# Altium project Main Processor Board.PrjPcb
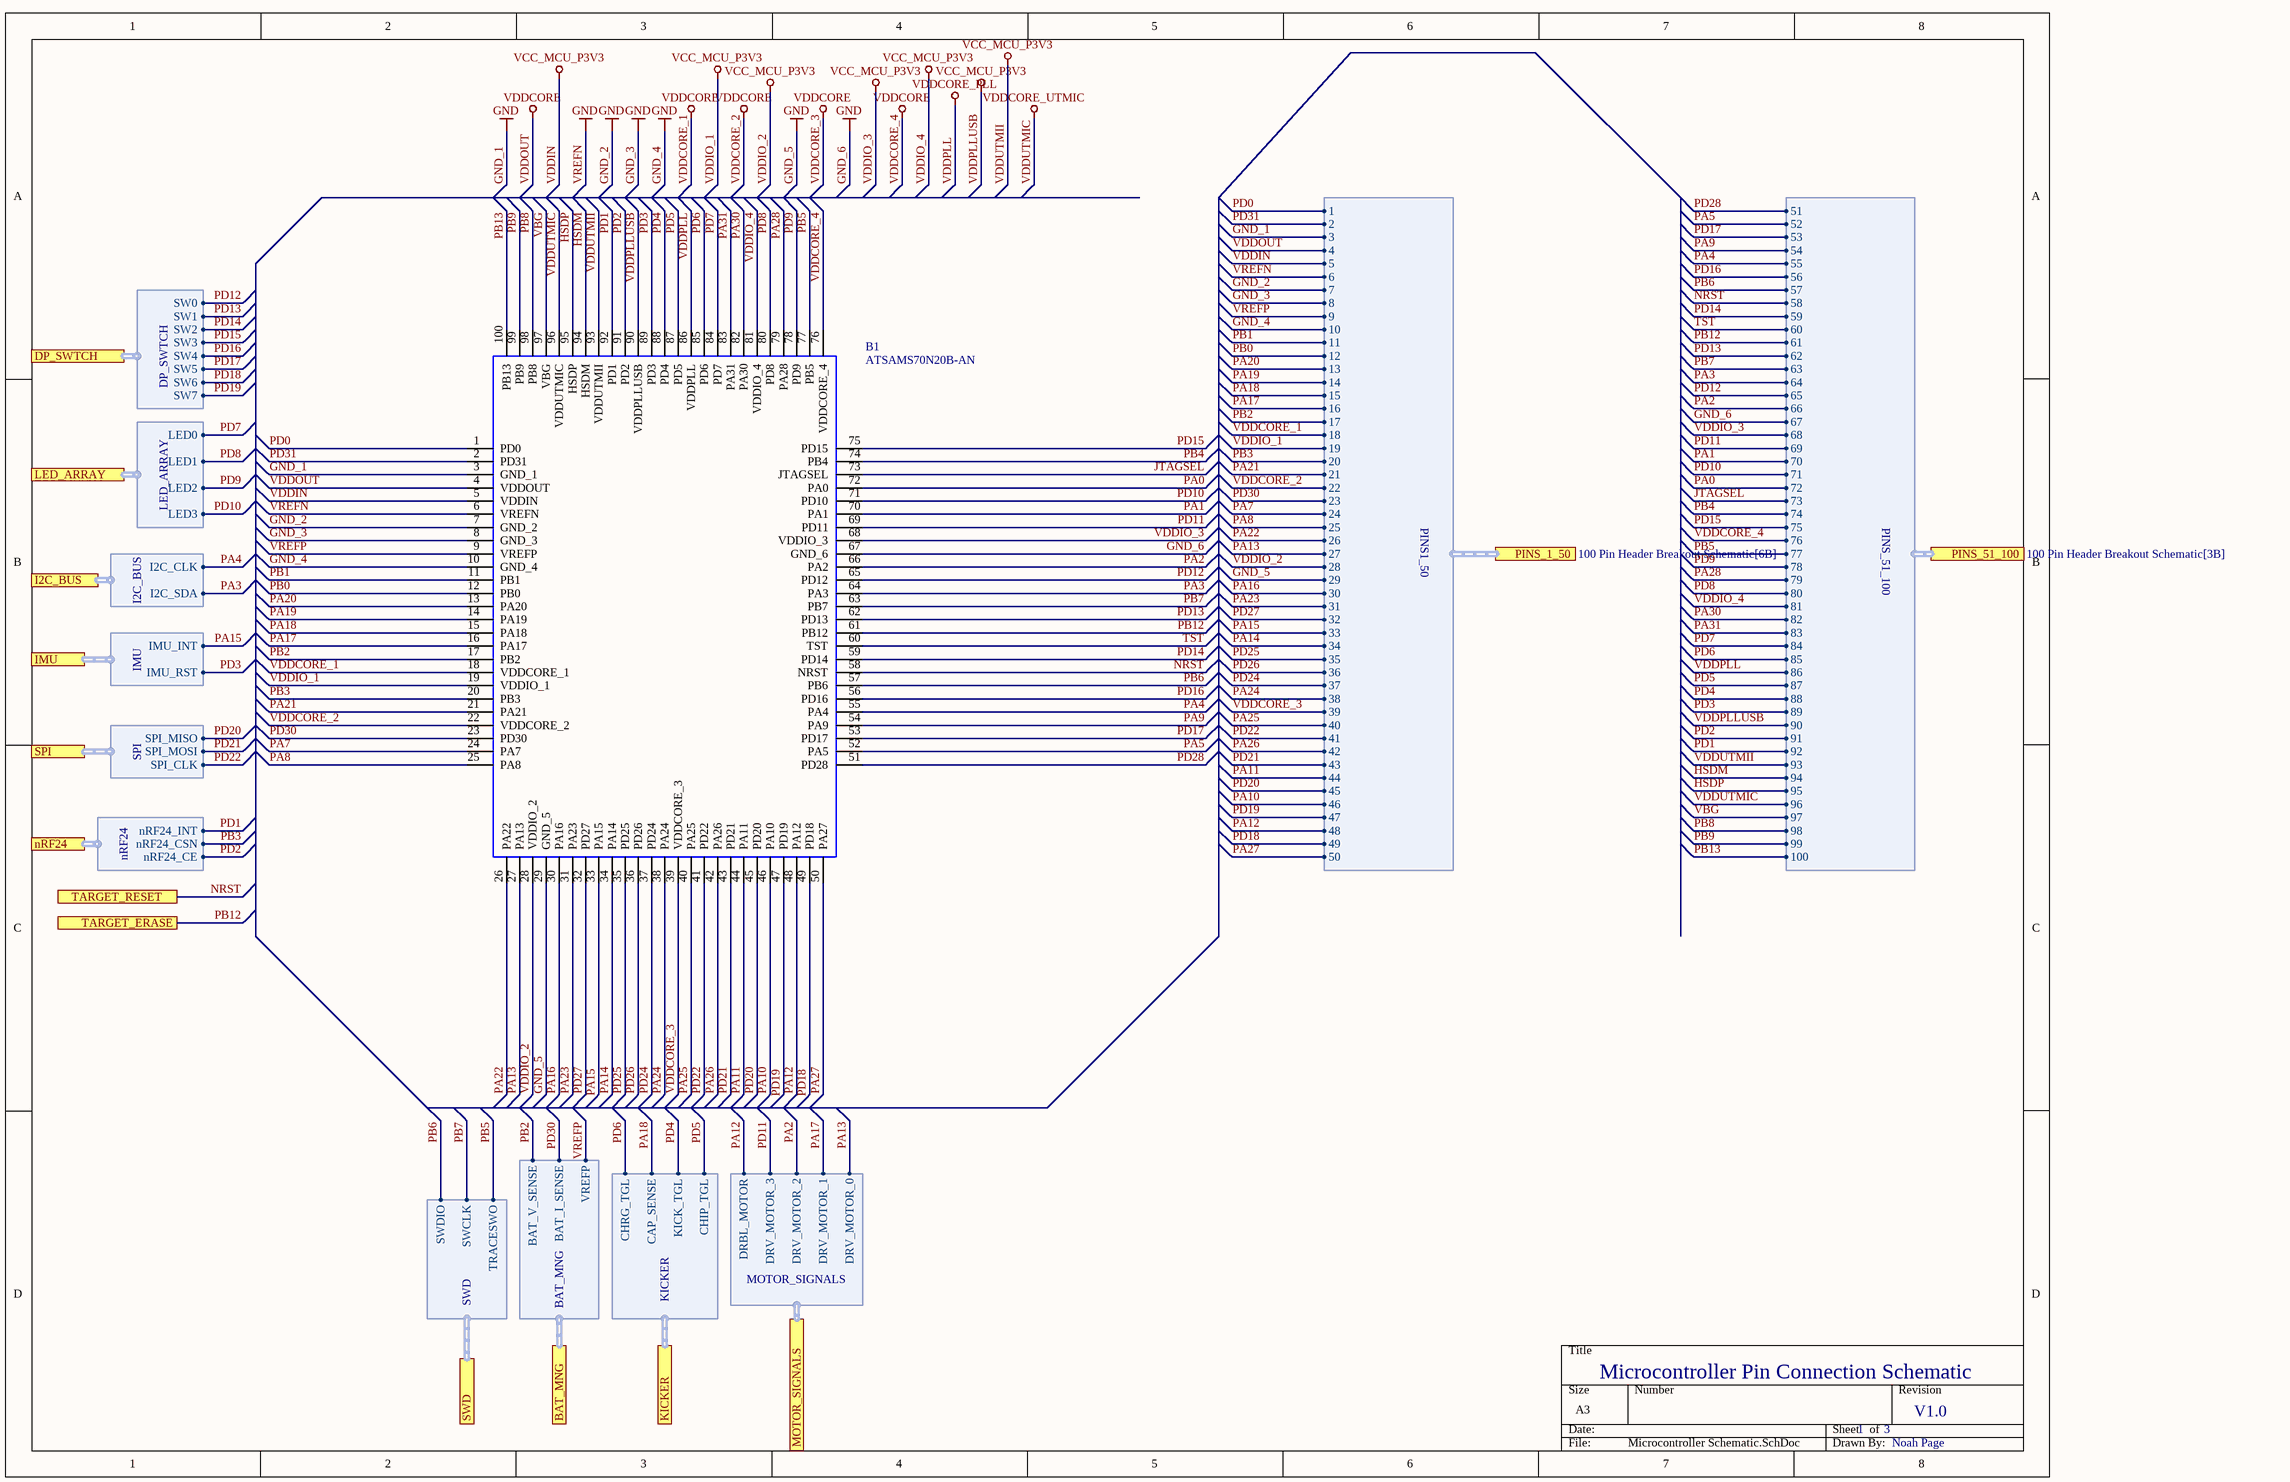
[diagram p0: Microcontroller Schematic.SchDoc]
3 sheets, 68 parts. Net scope: global (net labels, ports and power ports of the same name join across sheets).
Board file: Main Processor Board PCB.PcbDoc
Sheets:
  Microcontroller Schematic.SchDoc
  100 Pin Header Breakout Schematic.SchDoc
  Circuit Schematics.SchDoc

## Sheet Microcontroller Schematic.SchDoc
size A3; SheetNumber: 1; SheetTotal: 3

### Parts
B1  ATSAMS70N20B-AN  [QFP50P1600X1600X160-100N]

### Ports
BAT_MNG (harness BAT_MNG, see Circuit Schematics[6D]), DP_SWTCH (harness DP_SWTCH, see Circuit Schematics[1A]), I2C_BUS (harness I2C_BUS, see Circuit Schematics[1D], Circuit Schematics[3B], Circuit Schematics[6D]), IMU (harness IMU, see Circuit Schematics[1D]), KICKER (harness KICKER, see Circuit Schematics[6C]), LED_ARRAY (harness LED_ARRAY, see Circuit Schematics[1C]), MOTOR_SIGNALS (harness MOTOR_SIGNALS, see Circuit Schematics[5A]), nRF24 (harness nRF24, see Circuit Schematics[3D]), PINS_1_50 (harness PINS1_50, see 100 Pin Header Breakout Schematic[6B]), PINS_51_100 (harness PINS_51_100, see 100 Pin Header Breakout Schematic[3B]), SPI (harness SPI, see Circuit Schematics[3C]), SWD (harness SWD, see Circuit Schematics[5B]), TARGET_ERASE (see Circuit Schematics[3A]), TARGET_RESET (see Circuit Schematics[3A], Circuit Schematics[4B])

### Harnesses
DP_SWTCH: SW0, SW1, SW2, SW3, SW4, SW5, SW6, SW7
LED_ARRAY: LED0, LED1, LED2, LED3
I2C_BUS: I2C_CLK, I2C_SDA
IMU: IMU_INT, IMU_RST
SPI: SPI_MISO, SPI_MOSI, SPI_CLK
nRF24: nRF24_CSN, nRF24_CE, nRF24_INT
SWD: SWDIO, SWCLK, TRACESWO
BAT_MNG: BAT_V_SENSE, BAT_I_SENSE, VREFP
KICKER: CAP_SENSE, CHRG_TGL, KICK_TGL, CHIP_TGL
MOTOR_SIGNALS: DRV_MOTOR_0, DRV_MOTOR_1, DRV_MOTOR_2, DRV_MOTOR_3, DRBL_MOTOR
PINS1_50: 1, 2, 3, 4, 5, 6, 7, 8, 9, 10, 11, 12, 13, 14, 15, 16, 17, 18, 19, 20, 21, 22, 23, 24, 25, 26, 27, 28, 29, 30, 31, 32, 33, 34, 35, 36, 37, 38, 39, 40, 41, 42, 43, 44, 45, 46, 47, 48, 49, 50
PINS_51_100: 51, 52, 53, 54, 55, 56, 57, 58, 59, 60, 61, 62, 63, 64, 65, 66, 67, 68, 69, 70, 71, 72, 73, 74, 75, 76, 77, 78, 79, 80, 81, 82, 83, 84, 85, 86, 87, 88, 89, 90, 91, 92, 93, 94, 95, 96, 97, 98, 99, 100

### Nets
GND_1: B1.3(GND_1) B1.6(VREFN) B1.7(GND_2) B1.8(GND_3) B1.10(GND_4) B1.29(GND_5) B1.67(GND_6) ; port PINS_1_50.3, port PINS_1_50.6, port PINS_1_50.7, port PINS_1_50.8, port PINS_1_50.10, port PINS_1_50.29, port PINS_51_100.67  [also labelled GND, GND_2, GND_3, GND_4, GND_5, GND_6, VREFN]
VDDCORE_1: B1.4(VDDOUT) B1.18(VDDCORE_1) B1.22(VDDCORE_2) B1.39(VDDCORE_3) B1.76(VDDCORE_4) ; port PINS_1_50.4, port PINS_1_50.18, port PINS_1_50.22, port PINS_1_50.39, port PINS_51_100.76  [also labelled VDDCORE, VDDCORE_2, VDDCORE_3, VDDCORE_4, VDDOUT]
VDDIN: B1.5(VDDIN) B1.19(VDDIO_1) B1.28(VDDIO_2) B1.68(VDDIO_3) B1.81(VDDIO_4) B1.90(VDDPLLUSB) B1.93(VDDUTMII) ; port PINS_1_50.5, port PINS_1_50.19, port PINS_1_50.28, port PINS_51_100.68, port PINS_51_100.81, port PINS_51_100.90, port PINS_51_100.93  [also labelled VCC_MCU_P3V3, VDDIO_1, VDDIO_2, VDDIO_3, VDDIO_4, VDDPLLUSB, VDDUTMII]
VDDPLL: B1.86(VDDPLL) ; port PINS_51_100.86  [also labelled VDDCORE_PLL]
VDDUTMIC: B1.96(VDDUTMIC) ; port PINS_51_100.96  [also labelled VDDCORE_UTMIC]
HSDM: B1.94(HSDM) ; port PINS_51_100.94
HSDP: B1.95(HSDP) ; port PINS_51_100.95
JTAGSEL: B1.73(JTAGSEL) ; port PINS_51_100.73
NRST: B1.58(NRST) ; port TARGET_RESET, port PINS_51_100.58
PA0: B1.72(PA0) ; port PINS_51_100.72
PA1: B1.70(PA1) ; port PINS_51_100.70
PA2: B1.66(PA2) ; port MOTOR_SIGNALS.DRV_MOTOR_2, port PINS_51_100.66
PA3: B1.64(PA3) ; port I2C_BUS.I2C_SDA, port PINS_51_100.64
PA4: B1.55(PA4) ; port I2C_BUS.I2C_CLK, port PINS_51_100.55
PA5: B1.52(PA5) ; port PINS_51_100.52
PA7: B1.24(PA7) ; port PINS_1_50.24
PA8: B1.25(PA8) ; port PINS_1_50.25
PA9: B1.54(PA9) ; port PINS_51_100.54
PA10: B1.46(PA10) ; port PINS_1_50.46
PA11: B1.44(PA11) ; port PINS_1_50.44
PA12: B1.48(PA12) ; port MOTOR_SIGNALS.DRBL_MOTOR, port PINS_1_50.48
PA13: B1.27(PA13) ; port MOTOR_SIGNALS.DRV_MOTOR_0, port PINS_1_50.27
PA14: B1.34(PA14) ; port PINS_1_50.34
PA15: B1.33(PA15) ; port IMU.IMU_INT, port PINS_1_50.33
PA16: B1.30(PA16) ; port PINS_1_50.30
PA17: B1.16(PA17) ; port MOTOR_SIGNALS.DRV_MOTOR_1, port PINS_1_50.16
PA18: B1.15(PA18) ; port KICKER.CAP_SENSE, port PINS_1_50.15
PA19: B1.14(PA19) ; port PINS_1_50.14
PA20: B1.13(PA20) ; port PINS_1_50.13
PA21: B1.21(PA21) ; port PINS_1_50.21
PA22: B1.26(PA22) ; port PINS_1_50.26
PA23: B1.31(PA23) ; port PINS_1_50.31
PA24: B1.38(PA24) ; port PINS_1_50.38
PA25: B1.40(PA25) ; port PINS_1_50.40
PA26: B1.42(PA26) ; port PINS_1_50.42
PA27: B1.50(PA27) ; port PINS_1_50.50
PA28: B1.79(PA28) ; port PINS_51_100.79
PA30: B1.82(PA30) ; port PINS_51_100.82
PA31: B1.83(PA31) ; port PINS_51_100.83
PB0: B1.12(PB0) ; port PINS_1_50.12
PB1: B1.11(PB1) ; port PINS_1_50.11
PB2: B1.17(PB2) ; port BAT_MNG.BAT_V_SENSE, port PINS_1_50.17
PB3: B1.20(PB3) ; port nRF24.nRF24_CSN, port PINS_1_50.20
PB4: B1.74(PB4) ; port PINS_51_100.74
PB5: B1.77(PB5) ; port SWD.TRACESWO, port PINS_51_100.77
PB6: B1.57(PB6) ; port SWD.SWDIO, port PINS_51_100.57
PB7: B1.63(PB7) ; port SWD.SWCLK, port PINS_51_100.63
PB8: B1.98(PB8) ; port PINS_51_100.98
PB9: B1.99(PB9) ; port PINS_51_100.99
PB12: B1.61(PB12) ; port TARGET_ERASE, port PINS_51_100.61
PB13: B1.100(PB13) ; port PINS_51_100.100
PD0: B1.1(PD0) ; port PINS_1_50.1
PD1: B1.92(PD1) ; port nRF24.nRF24_INT, port PINS_51_100.92
PD2: B1.91(PD2) ; port nRF24.nRF24_CE, port PINS_51_100.91
PD3: B1.89(PD3) ; port IMU.IMU_RST, port PINS_51_100.89
PD4: B1.88(PD4) ; port KICKER.KICK_TGL, port PINS_51_100.88
PD5: B1.87(PD5) ; port KICKER.CHIP_TGL, port PINS_51_100.87
PD6: B1.85(PD6) ; port KICKER.CHRG_TGL, port PINS_51_100.85
PD7: B1.84(PD7) ; port LED_ARRAY.LED0, port PINS_51_100.84
PD8: B1.80(PD8) ; port LED_ARRAY.LED1, port PINS_51_100.80
PD9: B1.78(PD9) ; port LED_ARRAY.LED2, port PINS_51_100.78
PD10: B1.71(PD10) ; port LED_ARRAY.LED3, port PINS_51_100.71
PD11: B1.69(PD11) ; port MOTOR_SIGNALS.DRV_MOTOR_3, port PINS_51_100.69
PD12: B1.65(PD12) ; port DP_SWTCH.SW0, port PINS_51_100.65
PD13: B1.62(PD13) ; port DP_SWTCH.SW1, port PINS_51_100.62
PD14: B1.59(PD14) ; port DP_SWTCH.SW2, port PINS_51_100.59
PD15: B1.75(PD15) ; port DP_SWTCH.SW3, port PINS_51_100.75
PD16: B1.56(PD16) ; port DP_SWTCH.SW4, port PINS_51_100.56
PD17: B1.53(PD17) ; port DP_SWTCH.SW5, port PINS_51_100.53
PD18: B1.49(PD18) ; port DP_SWTCH.SW6, port PINS_1_50.49
PD19: B1.47(PD19) ; port DP_SWTCH.SW7, port PINS_1_50.47
PD20: B1.45(PD20) ; port SPI.SPI_MISO, port PINS_1_50.45
PD21: B1.43(PD21) ; port SPI.SPI_MOSI, port PINS_1_50.43
PD22: B1.41(PD22) ; port SPI.SPI_CLK, port PINS_1_50.41
PD24: B1.37(PD24) ; port PINS_1_50.37
PD25: B1.35(PD25) ; port PINS_1_50.35
PD26: B1.36(PD26) ; port PINS_1_50.36
PD27: B1.32(PD27) ; port PINS_1_50.32
PD28: B1.51(PD28) ; port PINS_51_100.51
PD30: B1.23(PD30) ; port BAT_MNG.BAT_I_SENSE, port PINS_1_50.23
PD31: B1.2(PD31) ; port PINS_1_50.2
TST: B1.60(TST) ; port PINS_51_100.60
VBG: B1.97(VBG) ; port PINS_51_100.97
VREFP: B1.9(VREFP) ; port BAT_MNG.VREFP, port PINS_1_50.9

### Notes on the sheet
- Microcontroller Pin Connection Schematic
- 1
- 3
- V1.0
- Noah Page

### Library data of the parts
B1 = ATSAMS70N20B-AN: ARM Microcontrollers - MCU CM7,1024kB Flash,384kB SRAM,LQFP100; Manufacturer_Name: Microchip; Geometry.Height: 1.6mm; Mouser Part Number: 556-ATSAMS70N20B-AN; Mouser Price/Stock: https://www.mouser.co.uk/ProductDetail/Microchip-Technology-Atmel/ATSAMS70N20B-AN?qs=rrS6PyfT74f9aEDiDShVYw%3D%3D; Manufacturer_Part_Number: ATSAMS70N20B-AN; Datasheet Link: https://datasheet.datasheetarchive.com/originals/distributors/DKDS41/DSANUWW0026633.pdf

## Sheet 100 Pin Header Breakout Schematic.SchDoc
size A3; SheetNumber: 2; SheetTotal: 3
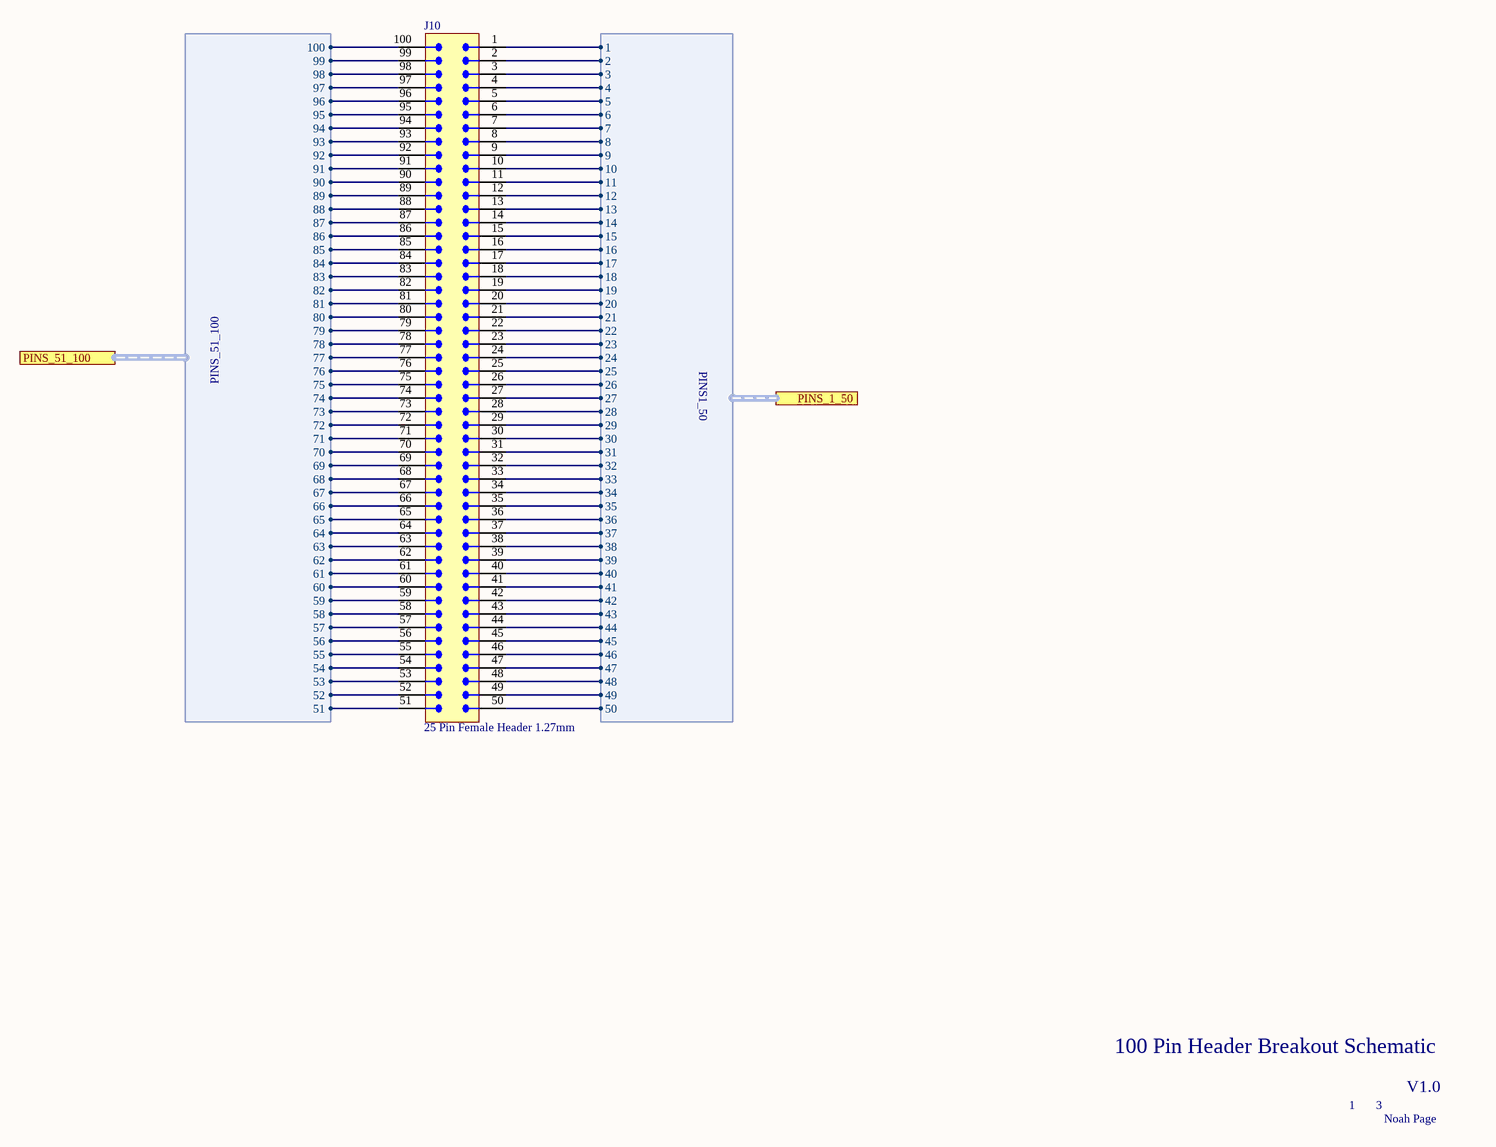
[diagram p1: 100 Pin Header Breakout Schematic.SchDoc]

### Parts
J10  25 Pin Female Header 1.27mm  [4x 25 Pin 1.27mm Female Header]

### Ports
PINS_1_50 (harness PINS1_50, see Microcontroller Schematic[6B]), PINS_51_100 (harness PINS_51_100, see Microcontroller Schematic[8B])

### Harnesses
PINS_51_100: 51, 52, 53, 54, 55, 56, 57, 58, 59, 60, 61, 62, 63, 64, 65, 66, 67, 68, 69, 70, 71, 72, 73, 74, 75, 76, 77, 78, 79, 80, 81, 82, 83, 84, 85, 86, 87, 88, 89, 90, 91, 92, 93, 94, 95, 96, 97, 98, 99, 100
PINS1_50: 1, 2, 3, 4, 5, 6, 7, 8, 9, 10, 11, 12, 13, 14, 15, 16, 17, 18, 19, 20, 21, 22, 23, 24, 25, 26, 27, 28, 29, 30, 31, 32, 33, 34, 35, 36, 37, 38, 39, 40, 41, 42, 43, 44, 45, 46, 47, 48, 49, 50

### Nets
GND_1: J10.3 J10.6 J10.7 J10.8 J10.10 J10.29 J10.67 ; port PINS_51_100.67, port PINS_1_50.3, port PINS_1_50.6, port PINS_1_50.7, port PINS_1_50.8, port PINS_1_50.10, port PINS_1_50.29
VDDCORE_1: J10.4 J10.18 J10.22 J10.39 J10.76 ; port PINS_51_100.76, port PINS_1_50.4, port PINS_1_50.18, port PINS_1_50.22, port PINS_1_50.39
VDDIN: J10.5 J10.19 J10.28 J10.68 J10.81 J10.90 J10.93 ; port PINS_51_100.68, port PINS_51_100.81, port PINS_51_100.90, port PINS_51_100.93, port PINS_1_50.5, port PINS_1_50.19, port PINS_1_50.28
VDDPLL: J10.86 ; port PINS_51_100.86
VDDUTMIC: J10.96 ; port PINS_51_100.96
HSDM: J10.94 ; port PINS_51_100.94
HSDP: J10.95 ; port PINS_51_100.95
JTAGSEL: J10.73 ; port PINS_51_100.73
NRST: J10.58 ; port PINS_51_100.58
PA0: J10.72 ; port PINS_51_100.72
PA1: J10.70 ; port PINS_51_100.70
PA2: J10.66 ; port PINS_51_100.66
PA3: J10.64 ; port PINS_51_100.64
PA4: J10.55 ; port PINS_51_100.55
PA5: J10.52 ; port PINS_51_100.52
PA7: J10.24 ; port PINS_1_50.24
PA8: J10.25 ; port PINS_1_50.25
PA9: J10.54 ; port PINS_51_100.54
PA10: J10.46 ; port PINS_1_50.46
PA11: J10.44 ; port PINS_1_50.44
PA12: J10.48 ; port PINS_1_50.48
PA13: J10.27 ; port PINS_1_50.27
PA14: J10.34 ; port PINS_1_50.34
PA15: J10.33 ; port PINS_1_50.33
PA16: J10.30 ; port PINS_1_50.30
PA17: J10.16 ; port PINS_1_50.16
PA18: J10.15 ; port PINS_1_50.15
PA19: J10.14 ; port PINS_1_50.14
PA20: J10.13 ; port PINS_1_50.13
PA21: J10.21 ; port PINS_1_50.21
PA22: J10.26 ; port PINS_1_50.26
PA23: J10.31 ; port PINS_1_50.31
PA24: J10.38 ; port PINS_1_50.38
PA25: J10.40 ; port PINS_1_50.40
PA26: J10.42 ; port PINS_1_50.42
PA27: J10.50 ; port PINS_1_50.50
PA28: J10.79 ; port PINS_51_100.79
PA30: J10.82 ; port PINS_51_100.82
PA31: J10.83 ; port PINS_51_100.83
PB0: J10.12 ; port PINS_1_50.12
PB1: J10.11 ; port PINS_1_50.11
PB2: J10.17 ; port PINS_1_50.17
PB3: J10.20 ; port PINS_1_50.20
PB4: J10.74 ; port PINS_51_100.74
PB5: J10.77 ; port PINS_51_100.77
PB6: J10.57 ; port PINS_51_100.57
PB7: J10.63 ; port PINS_51_100.63
PB8: J10.98 ; port PINS_51_100.98
PB9: J10.99 ; port PINS_51_100.99
PB12: J10.61 ; port PINS_51_100.61
PB13: J10.100 ; port PINS_51_100.100
PD0: J10.1 ; port PINS_1_50.1
PD1: J10.92 ; port PINS_51_100.92
PD2: J10.91 ; port PINS_51_100.91
PD3: J10.89 ; port PINS_51_100.89
PD4: J10.88 ; port PINS_51_100.88
PD5: J10.87 ; port PINS_51_100.87
PD6: J10.85 ; port PINS_51_100.85
PD7: J10.84 ; port PINS_51_100.84
PD8: J10.80 ; port PINS_51_100.80
PD9: J10.78 ; port PINS_51_100.78
PD10: J10.71 ; port PINS_51_100.71
PD11: J10.69 ; port PINS_51_100.69
PD12: J10.65 ; port PINS_51_100.65
PD13: J10.62 ; port PINS_51_100.62
PD14: J10.59 ; port PINS_51_100.59
PD15: J10.75 ; port PINS_51_100.75
PD16: J10.56 ; port PINS_51_100.56
PD17: J10.53 ; port PINS_51_100.53
PD18: J10.49 ; port PINS_1_50.49
PD19: J10.47 ; port PINS_1_50.47
PD20: J10.45 ; port PINS_1_50.45
PD21: J10.43 ; port PINS_1_50.43
PD22: J10.41 ; port PINS_1_50.41
PD24: J10.37 ; port PINS_1_50.37
PD25: J10.35 ; port PINS_1_50.35
PD26: J10.36 ; port PINS_1_50.36
PD27: J10.32 ; port PINS_1_50.32
PD28: J10.51 ; port PINS_51_100.51
PD30: J10.23 ; port PINS_1_50.23
PD31: J10.2 ; port PINS_1_50.2
TST: J10.60 ; port PINS_51_100.60
VBG: J10.97 ; port PINS_51_100.97
VREFP: J10.9 ; port PINS_1_50.9

### Notes on the sheet
- 100 Pin Header Breakout Schematic
- 1
- 3
- V1.0
- Noah Page

### Library data of the parts
J10 = 25 Pin Female Header 1.27mm: Digi-Key_Part_Number_1: 1212-1363-ND

## Sheet Circuit Schematics.SchDoc
size A3; SheetNumber: 3; SheetTotal: 3
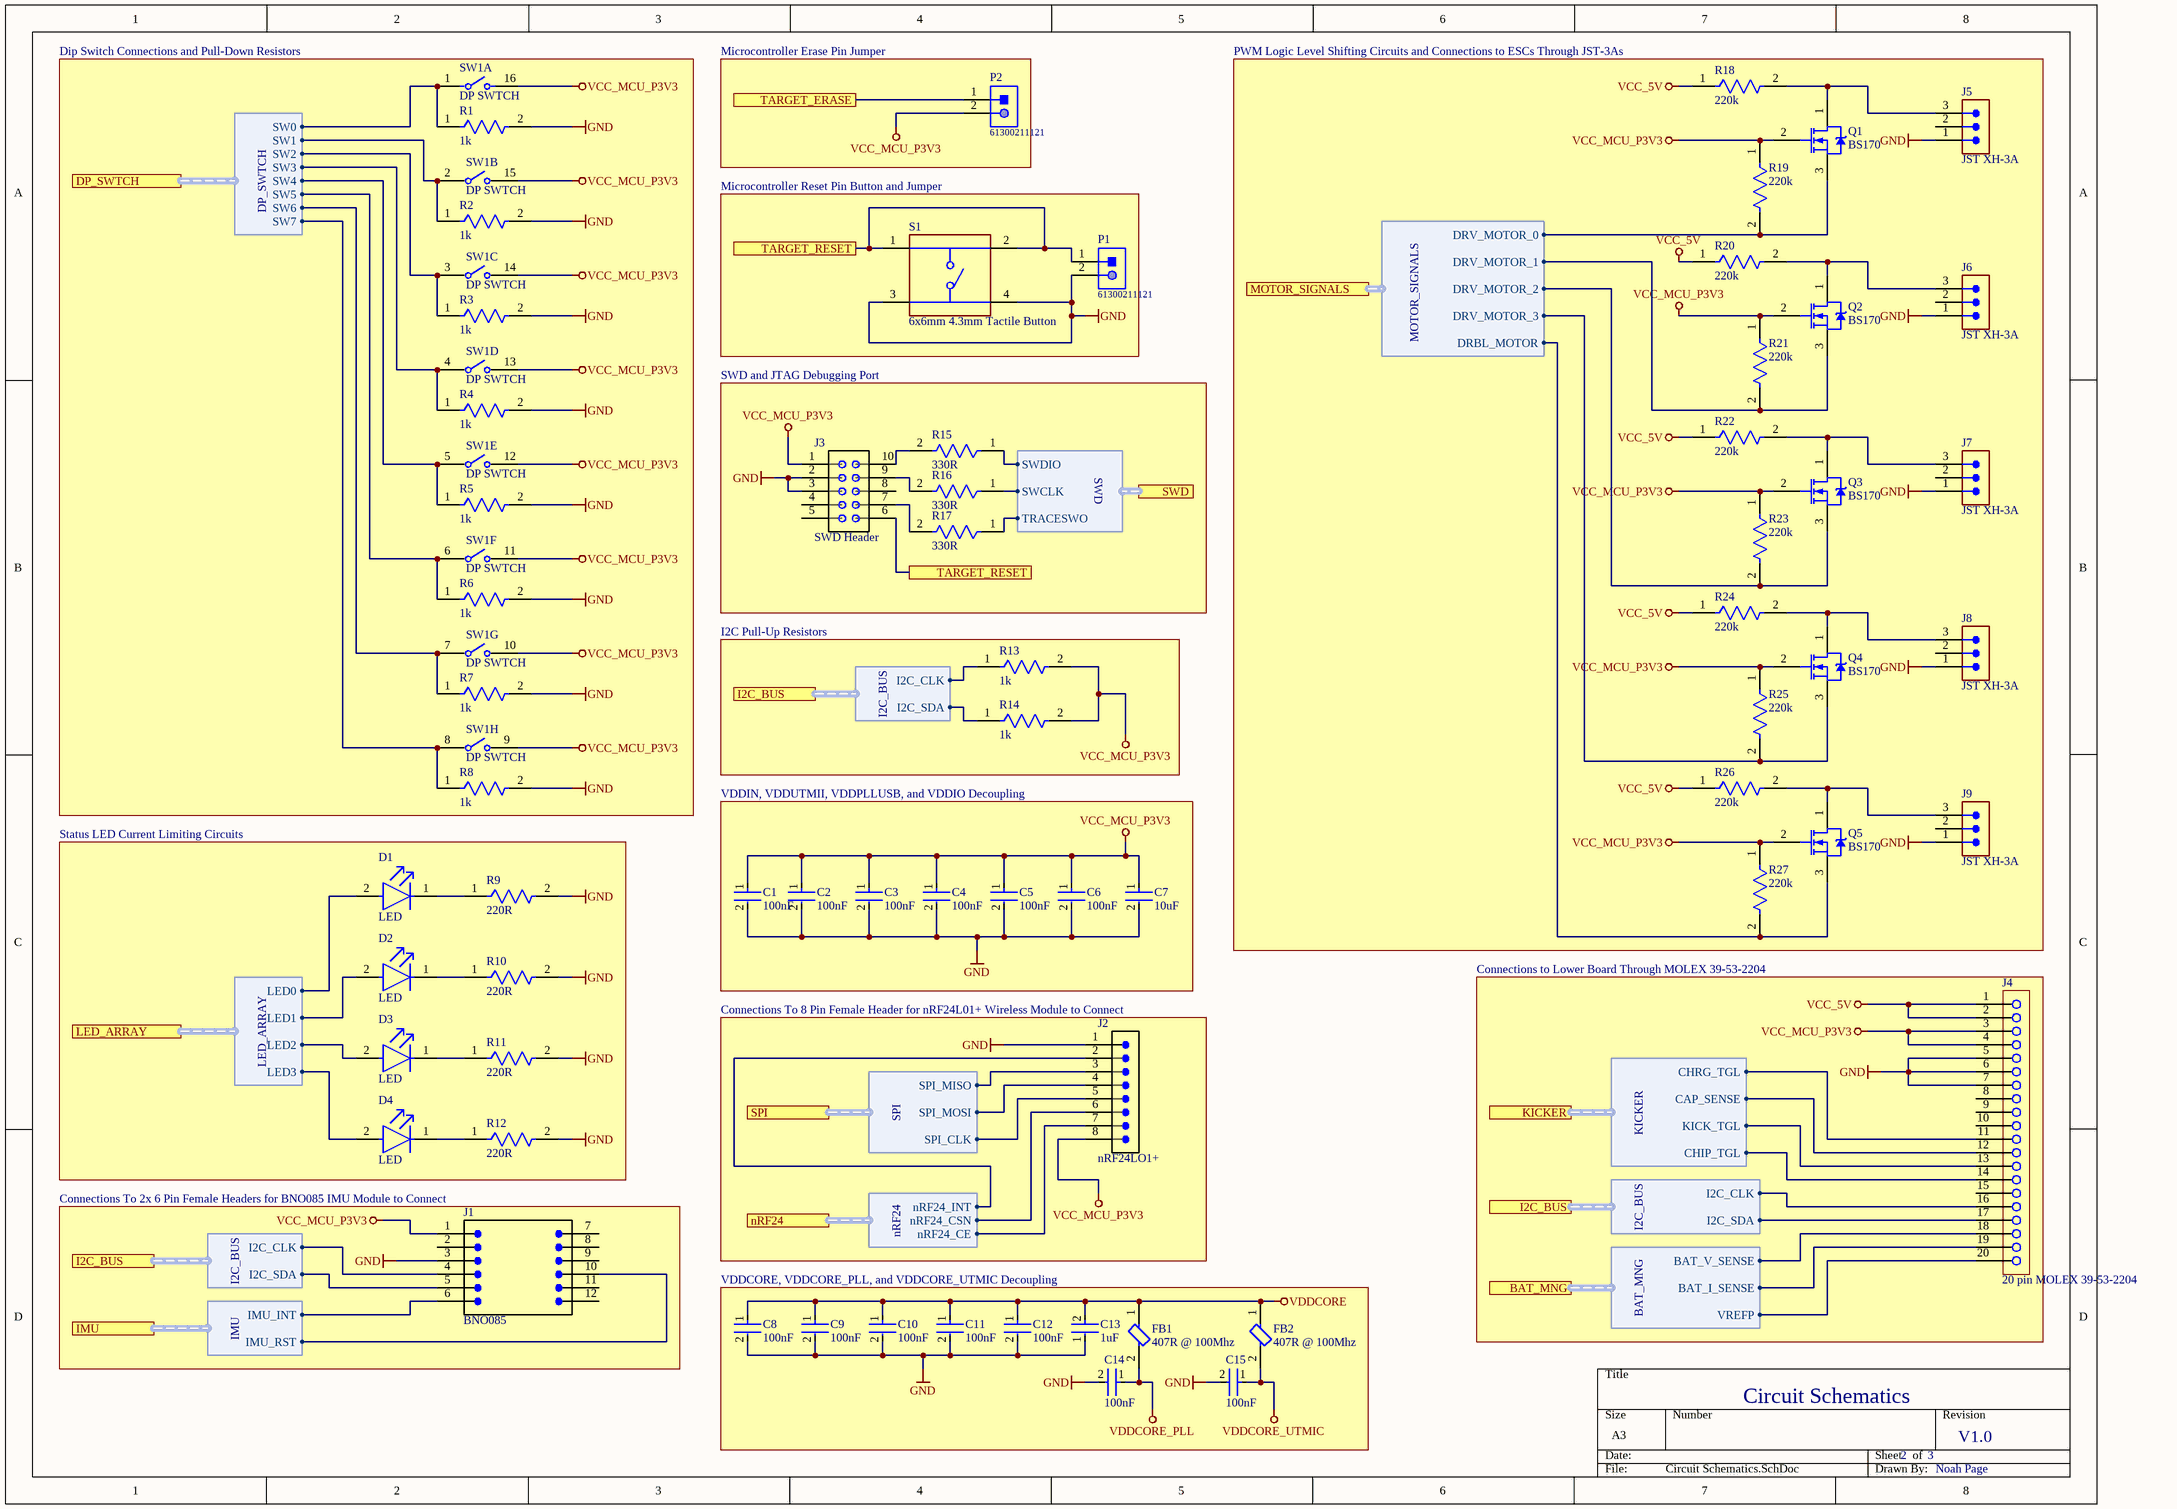
[diagram p2: Circuit Schematics.SchDoc]

### Parts
C1  100nF  [Capacitor 100nF 50V 20% 0603]
C2  100nF  [Capacitor 100nF 50V 20% 0603]
C3  100nF  [Capacitor 100nF 50V 20% 0603]
C4  100nF  [Capacitor 100nF 50V 20% 0603]
C5  100nF  [Capacitor 100nF 50V 20% 0603]
C6  100nF  [Capacitor 100nF 50V 20% 0603]
C7  10uF  [Capacitor 10uF 50V 20% 0805]
C8  100nF  [Capacitor 100nF 50V 20% 0603]
C9  100nF  [Capacitor 100nF 50V 20% 0603]
C10  100nF  [Capacitor 100nF 50V 20% 0603]
C11  100nF  [Capacitor 100nF 50V 20% 0603]
C12  100nF  [Capacitor 100nF 50V 20% 0603]
C13  1uF  [Capacitor 1uF 50V 10% 0603]
C14  100nF  [Capacitor 100nF 50V 20% 0603]
C15  100nF  [Capacitor 100nF 50V 20% 0603]
D1  LED  [LED RED 1206]
D2  LED  [LED RED 1206]
D3  LED  [LED RED 1206]
D4  LED  [LED RED 1206]
FB1  407R @ 100Mhz  [FERRITE BEAD 470R 100Mhz]
FB2  407R @ 100Mhz  [FERRITE BEAD 470R 100Mhz]
J1  BNO085  [(BNO085) FEMALE 2ct 8 unit separation 1x6 THT]
J2  nRF24LO1+  [(nRF24) FEMALE 1x8 2.54]
J3  SWD Header  [(SWD) FEMALE 10 pin 2 row 1.27mm]
J4  20 pin MOLEX 39-53-2204  [20Pin Molex 39-53-2204]
J5  JST XH-3A  [FP-B3B-XH-AM_LF_SN-MFG]
J6  JST XH-3A  [FP-B3B-XH-AM_LF_SN-MFG]
J7  JST XH-3A  [FP-B3B-XH-AM_LF_SN-MFG]
J8  JST XH-3A  [FP-B3B-XH-AM_LF_SN-MFG]
J9  JST XH-3A  [FP-B3B-XH-AM_LF_SN-MFG]
P1  61300211121  [2x 2.54mm MALE header pin]
P2  61300211121  [2x 2.54mm MALE header pin]
Q1  BS170  [MOSFET BS170]
Q2  BS170  [MOSFET BS170]
Q3  BS170  [MOSFET BS170]
Q4  BS170  [MOSFET BS170]
Q5  BS170  [MOSFET BS170]
R1  1k  [RESISTOR 1k 1% 1/4W 0603]
R2  1k  [RESISTOR 1k 1% 1/4W 0603]
R3  1k  [RESISTOR 1k 1% 1/4W 0603]
R4  1k  [RESISTOR 1k 1% 1/4W 0603]
R5  1k  [RESISTOR 1k 1% 1/4W 0603]
R6  1k  [RESISTOR 1k 1% 1/4W 0603]
R7  1k  [RESISTOR 1k 1% 1/4W 0603]
R8  1k  [RESISTOR 1k 1% 1/4W 0603]
R9  220R  [RESISTOR 220R 5% 1/4W 0603]
R10  220R  [RESISTOR 220R 5% 1/4W 0603]
R11  220R  [RESISTOR 220R 5% 1/4W 0603]
R12  220R  [RESISTOR 220R 5% 1/4W 0603]
R13  1k  [RESISTOR 1k 1% 1/4W 0603]
R14  1k  [RESISTOR 1k 1% 1/4W 0603]
R15  330R  [RESISTOR 330R 5% 1/4W 0603]
R16  330R  [RESISTOR 330R 5% 1/4W 0603]
R17  330R  [RESISTOR 330R 5% 1/4W 0603]
R18  220k  [RESISTOR 220k 5% 1/4W 0603]
R19  220k  [RESISTOR 220k 5% 1/4W 0603]
R20  220k  [RESISTOR 220k 5% 1/4W 0603]
R21  220k  [RESISTOR 220k 5% 1/4W 0603]
R22  220k  [RESISTOR 220k 5% 1/4W 0603]
R23  220k  [RESISTOR 220k 5% 1/4W 0603]
R24  220k  [RESISTOR 220k 5% 1/4W 0603]
R25  220k  [RESISTOR 220k 5% 1/4W 0603]
R26  220k  [RESISTOR 220k 5% 1/4W 0603]
R27  220k  [RESISTOR 220k 5% 1/4W 0603]
S1  6x6mm 4.3mm Tactile Button  [BUTTON 6x6x4.3 TACTILE SWITCH]
SW1  DP SWTCH  [8P DP SWTCH]  (parts A,B,C,D,E,F,G,H of 8)

### Blocks framed on the sheet
Dip Switch Connections and Pull-Down Resistors: R1-R8 SW1
Microcontroller Erase Pin Jumper: P2
Microcontroller Reset Pin Button and Jumper: P1 S1
SWD and JTAG Debugging Port: J3 R15-R17
I2C Pull-Up Resistors: R13 R14
VDDIN, VDDUTMII, VDDPLLUSB, and VDDIO Decoupling: C1-C7
Status LED Current Limiting Circuits: D1-D4 R9-R12
Connections to Lower Board Through MOLEX 39-53-2204: J4
VDDCORE, VDDCORE_PLL, and VDDCORE_UTMIC Decoupling: C8-C15 FB1 FB2

### Ports
BAT_MNG (harness BAT_MNG, see Microcontroller Schematic[3D]), DP_SWTCH (harness DP_SWTCH, see Microcontroller Schematic[1A]), I2C_BUS (harness I2C_BUS, see Circuit Schematics[1D], Circuit Schematics[3B], Microcontroller Schematic[1B]), I2C_BUS (harness I2C_BUS, see Circuit Schematics[1D], Circuit Schematics[6D], Microcontroller Schematic[1B]), I2C_BUS (harness I2C_BUS, see Circuit Schematics[3B], Circuit Schematics[6D], Microcontroller Schematic[1B]), IMU (harness IMU, see Microcontroller Schematic[1B]), KICKER (harness KICKER, see Microcontroller Schematic[3D]), LED_ARRAY (harness LED_ARRAY, see Microcontroller Schematic[1B]), MOTOR_SIGNALS (harness MOTOR_SIGNALS, see Microcontroller Schematic[4D]), nRF24 (harness nRF24, see Microcontroller Schematic[1C]), SPI (harness SPI, see Microcontroller Schematic[1C]), SWD (harness SWD, see Microcontroller Schematic[2D]), TARGET_ERASE (see Microcontroller Schematic[1C]), TARGET_RESET (see Circuit Schematics[3A], Microcontroller Schematic[1C]), TARGET_RESET (see Circuit Schematics[4B], Microcontroller Schematic[1C])

### Harnesses
DP_SWTCH: SW0, SW1, SW2, SW3, SW4, SW5, SW6, SW7
LED_ARRAY: LED0, LED1, LED2, LED3
I2C_BUS: I2C_CLK, I2C_SDA
IMU: IMU_INT, IMU_RST
SPI: SPI_MISO, SPI_MOSI, SPI_CLK
nRF24: nRF24_CSN, nRF24_CE, nRF24_INT
SWD: SWDIO, SWCLK, TRACESWO
BAT_MNG: BAT_V_SENSE, BAT_I_SENSE, VREFP
KICKER: CHRG_TGL, CAP_SENSE, KICK_TGL, CHIP_TGL
MOTOR_SIGNALS: DRV_MOTOR_0, DRV_MOTOR_1, DRV_MOTOR_2, DRV_MOTOR_3, DRBL_MOTOR

### Nets
GND: C1.2 C2.2 C3.2 C4.2 C5.2 C6.2 C7.2 C8.2 C9.2 C10.2 C11.2 C12.2 C13.1 C14.2 C15.2 J1.3 J2.1 J3.2 J3.3 J4.5 J4.6 J4.7 J5.1 J6.1 J7.1 J8.1 J9.1 P1.2 R1.2 R2.2 R3.2 R4.2 R5.2 R6.2 R7.2 R8.2 R9.2 R10.2 R11.2 R12.2 S1.3 S1.4  [project net GND_1]
VCC_5V: J4.1 J4.2 R18.1 R20.1 R22.1 R24.1 R26.1
VCC_MCU_P3V3: C1.1 C2.1 C3.1 C4.1 C5.1 C6.1 C7.1 J1.1 J2.8 J3.1 J4.3 J4.4 P2.2 Q1.2(G) Q2.2(G) Q3.2(G) Q4.2(G) Q5.2(G) R13.2 R14.2 R19.1 R21.1 R23.1 R25.1 R27.1 SW1.9 SW1.10 SW1.11 SW1.12 SW1.13 SW1.14 SW1.15 SW1.16  [project net VDDIN]
VDDCORE: C8.1 C9.1 C10.1 C11.1 C12.1 C13.2 FB1.1 FB2.1  [project net VDDCORE_1]
VDDCORE_PLL: C14.1 FB1.2  [project net VDDPLL]
VDDCORE_UTMIC: C15.1 FB2.2  [project net VDDUTMIC]
NRST: J3.6 P1.1 S1.1 S1.2 ; port TARGET_RESET
PA2: Q3.3(S) R23.2 ; port MOTOR_SIGNALS.DRV_MOTOR_2
PA3: J1.5 J4.17 R14.1 ; port I2C_BUS.I2C_SDA
PA4: J1.4 J4.16 R13.1 ; port I2C_BUS.I2C_CLK
PA12: Q5.3(S) R27.2 ; port MOTOR_SIGNALS.DRBL_MOTOR
PA13: Q1.3(S) R19.2 ; port MOTOR_SIGNALS.DRV_MOTOR_0
PA15: J1.6 ; port IMU.IMU_INT
PA17: Q2.3(S) R21.2 ; port MOTOR_SIGNALS.DRV_MOTOR_1
PA18: J4.12 ; port KICKER.CAP_SENSE
PB2: J4.18 ; port BAT_MNG.BAT_V_SENSE
PB3: J2.6 ; port nRF24.nRF24_CSN
PB5: R17.1 ; port SWD.TRACESWO
PB6: R15.1 ; port SWD.SWDIO
PB7: R16.1 ; port SWD.SWCLK
PB12: P2.1 ; port TARGET_ERASE
PD1: J2.2 ; port nRF24.nRF24_INT
PD2: J2.7 ; port nRF24.nRF24_CE
PD3: J1.10 ; port IMU.IMU_RST
PD4: J4.13 ; port KICKER.KICK_TGL
PD5: J4.14 ; port KICKER.CHIP_TGL
PD6: J4.11 ; port KICKER.CHRG_TGL
PD7: D1.2(A) ; port LED_ARRAY.LED0
PD8: D2.2(A) ; port LED_ARRAY.LED1
PD9: D3.2(A) ; port LED_ARRAY.LED2
PD10: D4.2(A) ; port LED_ARRAY.LED3
PD11: Q4.3(S) R25.2 ; port MOTOR_SIGNALS.DRV_MOTOR_3
PD12: R1.1 SW1.1 ; port DP_SWTCH.SW0
PD13: R2.1 SW1.2 ; port DP_SWTCH.SW1
PD14: R3.1 SW1.3 ; port DP_SWTCH.SW2
PD15: R4.1 SW1.4 ; port DP_SWTCH.SW3
PD16: R5.1 SW1.5 ; port DP_SWTCH.SW4
PD17: R6.1 SW1.6 ; port DP_SWTCH.SW5
PD18: R7.1 SW1.7 ; port DP_SWTCH.SW6
PD19: R8.1 SW1.8 ; port DP_SWTCH.SW7
PD20: J2.3 ; port SPI.SPI_MISO
PD21: J2.4 ; port SPI.SPI_MOSI
PD22: J2.5 ; port SPI.SPI_CLK
PD30: J4.19 ; port BAT_MNG.BAT_I_SENSE
VREFP: J4.20 ; port BAT_MNG.VREFP
NetD1_1: D1.1(C) R9.1
NetD2_1: D2.1(C) R10.1
NetD3_1: D3.1(C) R11.1
NetD4_1: D4.1(C) R12.1
NetJ3_7: J3.7 R17.2
NetJ3_9: J3.9 R16.2
NetJ3_10: J3.10 R15.2
NetJ5_3: J5.3 Q1.1(D) R18.2
NetJ6_3: J6.3 Q2.1(D) R20.2
NetJ7_3: J7.3 Q3.1(D) R22.2
NetJ8_3: J8.3 Q4.1(D) R24.2
NetJ9_3: J9.3 Q5.1(D) R26.2

Not connected (* = marked no-connect by the designer): J1 2 7 8 9 11 12; J3 4 5 8; J4 8 9 10 15; J5 2; J6 2; J7 2; J8 2; J9 2

### Notes on the sheet
- (near R18) PWM Logic Level Shifting Circuits and Connections to ESCs Through JST-3As
- (near J2) Connections To 8 Pin Female Header for nRF24L01+ Wireless Module to Connect
- (near J1) Connections To 2x 6 Pin Female Headers for BNO085 IMU Module to Connect
- Circuit Schematics
- 2
- 3
- V1.0
- Noah Page

### Library data of the parts
C1-C6 C8-C12 C14 C15 = Capacitor 100nF 50V 20% 0603: Cap Ceramic 100nF 50V X7R ±20% Pad SMD 0603 +125°C T/R; Mount: Surface Mount; Lead Free: Lead Free; Max Operating Temperature: 125°C; Voltage Rating: 50V; Case Code (Imperial): 0603; Capacitance: 100nF; Height: 0.8mm; Length: 1.6mm; Tolerance: 20%; Case Code (Metric): 1608; Thickness: 0.035inch; Depth: 0.8mm; Width: 0.031inch; Package Quantity: 1; Min Operating Temperature: -55°C; Case/Package: 0603; Radiation Hardening: No; Voltage Rating (DC): 50V; Dielectric: X7R; Packaging: Tape and Reel; Digi-Key_Part_Number_1: 1276-1941-1-ND
C7 = Capacitor 10uF 50V 20% 0805: Chip Multilayer Ceramic Capacitors for General Purpose, 0805, 10uF, X5R, 15%, 20%, 50V; Digi-Key_Part_Number_1: 490-18664-1-ND
C13 = Capacitor 1uF 50V 10% 0603: Multilayer Ceramic Capacitors 1μF ±10% 50V X5R SMD 0603; Lead Free: Lead Free; Height: 0.8mm; Mount: Surface Mount; Radiation Hardening: No; Thickness: 0.035inch; Length: 1.6mm; Max Operating Temperature: 85°C; REACH SVHC: No SVHC; Min Operating Temperature: -55°C; Construction: Flat; RoHS Compliant: Yes; Voltage Rating: 50V; Dielectric: X5R; Packaging: Tape and Reel; Termination: SMD/SMT; Voltage Rating (DC): 50V; Case Code (Imperial): 0603; Voltage: 50V; Width: 0.031inch; Weight: 7.1E-05oz; Capacitance: 1uF; Depth: 0.8mm; Case Code (Metric): 1608; Series: C; Case/Package: 0603; Tolerance: 10%; Resistor Type: Ceramic; Number of Pins: 2; Dielectric Material: Ceramic; Package Quantity: 1; Digi-Key_Part_Number_1: 445-7468-1-ND
D1-D4 = LED RED 1206: LED RED DIFFUSED 1206 SMD; Manufacturer: VCC; Manufacturer Part Number: CMD15-21VRD/TR8; Led Orientation: Top View; Peak Emmision Wavelength: 640nm; Forward Current: 20mA; Power Dissipation: 105mW; Luminous Intensity: 4mcd; Forward Voltage: 2V; Reverse Voltage: 5V; Lead Free: Yes; Device Class L1: Optoelectronics; Package: CMD15-21; Temperature Range High: +85°C; Digikey Description: LED RED DIFFUSED 1206 SMD; Mouser Description: Standard LEDs - SMD RED DIFFUSED; Height: 1.3mm; ComponentLink2Description: Datasheet; ComponentLink2URL: https://www.vcclite.com/wp-content/uploads/wpallimport/files/files/CMD1521SeriesRev1.pdf; Temperature: -40°C to +85°C; Automotive: No; Octopart: https://octopart.com/cmd15-21vrd%2Ftr8-vcc-26668835; Temperature Range Low: -40°C; Device Class L3: unset; Colour: Red; Category: Diode; Device Class L2: LEDs; RoHS: TRUE; Digi-Key_Part_Number_1: L62301CT-ND
FB1 FB2 = Ferrite Bead 470R @ 100Mhz 25%: Chip Ferrite Bead, 0603, 470Ω @ 100MHz, 0.35Ω, 25%, 550mA; Resistance: 350mR; Number of Circuits: 1; Max DC Current: 500mA; Shielding: Unshielded; Impedance: 470R; Weight: 7.1E-05oz; Ratings: AEC-Q200; Contact Plating: Tin; Package Quantity: 4000; Case/Package: 0603; Number of Pins: 2; Core Material: Ferrite; Height: 0.037inch; Lead Free: Lead Free; Max Operating Temperature: 125°C; Width: 0.031inch; Termination: Flat; Case Code (Metric): 1608; Case Code (Imperial): 0603; Tolerance: 25%; Depth: 0.8mm; Min Operating Temperature: -55°C; Max Current Rating: 550mA; Packaging: Tape and Reel; Mount: Surface Mount; Length: 1.6mm; Radiation Hardening: No; Number of Lines: 1; Test Frequency: 100MHz; REACH SVHC: No SVHC; DC Resistance (DCR): 350mR; Digi-Key_Part_Number_1: 490-11025-1-ND
J1 = (BNO085) FEMALE 2ct 8 unit separation 1x6 THT: No Description Available; Mfr_Name: Sullins; Manufacturer_Part_Number: PPTC061LFBN-RC; Copyright: Copyright (C) 2022 Ultra Librarian. All rights reserved.; Digi-Key_Part_Number_1: S7004-ND; RefDes: RefDes; Type: DEV
J2 = (nRF24) FEMALE 1x8 2.54: No Description Available; Mfr_Name: Sullins; Manufacturer_Part_Number: PPTC081LFBN-RC; Copyright: Copyright (C) 2022 Ultra Librarian. All rights reserved.; Digi-Key_Part_Number_1: S7006-ND; RefDes: RefDes; Type: DEV
J3 = (SWD) FEMALE 10 pin 2 row 1.27mm: No Description Available; Mfr_Name: CNC Tech; Manufacturer_Part_Number: 3220-10-0100-00; Copyright: Copyright (C) 2022 Ultra Librarian. All rights reserved.; Digi-Key_Part_Number_1: 1175-1627-ND; RefDes: RefDes; Type: DEV
J4 = 20 pin MOLEX 39-53-2204: 1.25 mm Pitch FPC Connector, 5.0 mm Mated Height, Right Angle, ZIF, Through Hole, Top Contact, 20 Circuits, -20 to 80 degC, ELV and RoHS Compliant, Tray; PCB Locator: No; Voltage (Max): 200V; Pitch - Mating Interface: 1.25mm; Entry Angle: 90degrees Angle; PCB Retention: None; Circuits (Loaded): 20; Material - Plating Termination: Tin-Bismuth; Material - Metal: Phosphor Bronze; Current (Max per Contact): 1A; Mated Height: 5.00mm; Durability (mating cycles max): 30; ComponentLink1Description: Manufacturer URL; ComponentLink2Description: Datasheet; ComponentLink1URL: http://www.molex.com/molex/index.jsp; ComponentLink3Description: Package Specification; Polarized to PCB: No; Packing: Tray; Contact Position: Top; ComponentLink2URL: http://www.molex.com/webdocs/datasheets/pdf/en-us/0039532204_FFC_FPC_CONNECTORS.pdf; Number of Rows: 1; ComponentLink3URL: http://www.molex.com/pdm_docs/sd/039532204_sd.pdf; PackageDescription: 20-Lead FPC Connector, Pitch 1.25 mm; Mounting Technology: Through Hole; Stackable: No; RoHS: TRUE; PartNumber: 39-53-2204; Orientation: Right Angle; PackageVersion: Rev. B, 04/2007; PackageReference: 39-53-2204; Manufacturer: Molex; Material - Plating Mating: Tin-Bismuth; Digi-Key_Part_Number_1: WM4444-ND
J5-J9 = 3pin JSTHX MALE: CONN HEADER VERT 3POS 2.5MM; Max Current Rating: 3A; Gender: Male; Max Voltage Rating (AC): 250V; Connector Type: Male Pin; Pitch: 0.098inch; Number of Positions: 3; Contact Resistance: 20mR; Termination: Press-Fit; Housing Color: White; Housing Material: Polyamide; Orientation: Straight; Contact Material: Brass; Contact Type: Male Pin; Color: Natural; Packaging: Bulk; Lead Free: Lead Free; Depth: 5.75mm; Number of Rows: 1; Contact Plating: Tin; Length: 9.9mm; Max Operating Temperature: 85°C; Series: XH; Min Operating Temperature: -25°C; Fastening Type: Detent; Mount: Through Hole; Digi-Key_Part_Number_1: 455-2231-ND
P1 P2 = 2x 2.54mm Male Header: THT Vertical Pin Header WR-PHD, Pitch 2.54 mm, Single Row, 2 pins; Manufacturer: Wurth Elektronik; Rated Current: 3A; Gender: Male; Withstanding Voltage: 500VAC; Working Voltage: 250VAC; Pitch: 2.54mm; Contact Resistance: 20mOhm; Pin Number: 2; Mounting Technology: THT; Orientation: Vertical; Operating Temperature: -40to105degC; Packaging: Bag; Publisher: WurthElektronik; Datasheet URL: https://katalog.we-online.de/em/datasheet/6130xx11121.pdf; Manufacturer URL: http://www.we-online.de; Row Number: Single; Package Reference: 61300211121; Part Number: 61300211121; Digi-Key_Part_Number_1: 732-5315-ND
Q1-Q5 = MOSFET Transistor NChannel Logic Level BS170: Small Signal MOSFET, 500 mA, 60 V, N-Channel, 3-Pin TO-92, Bulk Box; Manufacturer: On Semiconductor; VGS Max (V): 20; Configuration: Single; PD Max (W): 0.35; VGS(th) Max (V): 3; ID Max (A): 0.5; V(BR)DSS Min (V): 60; PackageDescription: 3-Pin Transistor Outline, Body 4.825 x 3.685 mm, Pitch 1.27 mm; Package Type: TO-92; ComponentLink1Description: Manufacturer URL; ComponentLink1URL: http://www.onsemi.com/; DatasheetVersion: Rev. 6; ComponentLink3Description: Package Specification; PartNumber: BS170; ComponentLink2URL: http://www.onsemi.com/pub_link/Collateral/BS170-D.PDF; PackageVersion: Rev. AM; Mounting Technology: Through Hole; PackageReference: TO-92-3-29-11_AM_SL; ComponentLink2Description: Datasheet; ComponentLink3URL: http://www.onsemi.cn/pub_link/Collateral/2N6426-D.PDF; Channel Polarity: N Channel; Packing: Bulk Box; Digi-Key_Part_Number_1: 2368-BS170-ND
R1-R8 R13 R14 = Resistor 1k 1% 0.25W 0603: 1kΩ ±1% 0.25W 0603 Anti-Surge Chip Resistor AEC-Q200; Power Rating: 250mW; Resistance: 1kR; Temperature Coefficient: 100ppm/°C; Series: ESR; Max Operating Temperature: 155°C; Case Code (Metric): 1608; Package Quantity: 1; Case/Package: 0603; Size Code: 0603; Case Code (Imperial): 0603; Min Operating Temperature: -55°C; Tolerance: 1%; Max Power Dissipation: 250mW; Number of Terminations: 2; RoHS Compliant: Yes; Lead Free: Lead Free; Packaging: Tape and Reel; Height: 0.022inch; Width: 0.031inch; Features: Automotive AEC-Q200; Resistor Type: Thick Film; Length: 0.063inch; Digi-Key_Part_Number_1: RHM1.00KADCT-ND
R9-R12 = Resistor 220R 5% 0.25W 0603: 220Ω ±5% 0.25W 0603 Anti-Surge Chip Resistor AEC-Q200; Max Power Dissipation: 250mW; Temperature Coefficient: 200ppm/°C; Max Operating Temperature: 155°C; Resistor Type: Thick Film; Case/Package: 0603; Features: Automotive AEC-Q200; Case Code (Imperial): 0603; Series: ESR; Number of Terminations: 2; RoHS Compliant: Yes; Case Code (Metric): 1608; Resistance: 220R; Tolerance: 5%; Lead Free: Lead Free; Length: 0.063inch; Height: 0.022inch; Packaging: Tape and Reel; Width: 0.031inch; Package Quantity: 1; Min Operating Temperature: -55°C; Digi-Key_Part_Number_1: RHM220DCT-ND
R15-R17 = Resistor 330R 5% 0.25W 0603: 330Ω ±5% 0.25W 0603 Anti-Surge Chip Resistor AEC-Q200; Temperature Coefficient: 200ppm/°C; Max Power Dissipation: 250mW; Case/Package: 0603; Case Code (Metric): 1608; RoHS Compliant: Yes; Max Operating Temperature: 155°C; Packaging: Tape and Reel; Resistance: 330R; Features: Automotive AEC-Q200; Width: 0.8mm; Case Code (Imperial): 0603; Length: 1.6mm; Height: 0.45mm; Min Operating Temperature: -55°C; Series: ESR; Tolerance: 5%; Number of Terminations: 2; Digi-Key_Part_Number_1: RHM330DCT-ND
R18-R27 = Resistor 220k 5% 0.25W 0603: 220kΩ ±5% 0.25W 0603 Anti-Surge Chip Resistor AEC-Q200; Resistance: 220kR; Max Power Dissipation: 250mW; Temperature Coefficient: 200ppm/°C; Case/Package: 0603; Min Operating Temperature: -55°C; Case Code (Imperial): 0603; Width: 0.031inch; Length: 0.063inch; Packaging: Tape and Reel; Height: 0.022inch; Tolerance: 5%; Features: Automotive AEC-Q200; Max Operating Temperature: 155°C; Case Code (Metric): 1608; Number of Terminations: 2; RoHS Compliant: Yes; Resistor Type: Thick Film; Package Quantity: 5000; Series: ESR; Digi-Key_Part_Number_1: RHM220KDCT-ND
S1 = 6x6mm 4.3mm Tactile Button: 6 x 6 mm, 4.3 mm Actuator Height, 160 gf, Black, Long Crimped, Through Hole, SPST, Tactile Switch; MF: CUI Devices; MP: TS02-66-43-BK-160-LCR-D; SnapEDA_Link: https://www.snapeda.com/parts/TS02-66-43-BK-160-LCR-D/CUI+Devices/view-part/?ref=snap; Check_prices: https://www.snapeda.com/parts/TS02-66-43-BK-160-LCR-D/CUI+Devices/view-part/?ref=eda; Availability: In Stock; Value: *; Package: None; Purchase-URL: https://pricing.snapeda.com/search/part/TS02-66-43-BK-160-LCR-D/?ref=eda; Price: None; CUI_purchase_URL: https://www.cuidevices.com/product/switches/tactile-switches/ts02-series?utm_source=snapeda.com&utm_medium=referral&utm_campaign=snapedaBOM; Digi-Key_Part_Number_1: 2223-TS02-66-43-BK-160-LCR-D-ND
SW1 = 8Pin 20V 100mA Dip Switch: SWITCH SLIDE DIP SPST 100MA 20V; Washable: Yes; Pitch: 0.1inch; Electrical Life: 2000Cycles; Number of Positions: 8; Actuator Type: Slide (Standard); Lead Free: Lead Free; Radiation Hardening: No; Packaging: Tape and Reel; Contact Plating: Gold; Throw Configuration: SPST; Depth: 9.91mm; Min Operating Temperature: -55°C; Termination: Gull Wing; Max Voltage Rating (DC): 20V; Mount: Surface Mount; Package Quantity: 1000; Voltage Rating (DC): 20V; Mechanical Life: 2000Cycles; Orientation: Straight; Max Operating Temperature: 85°C; Max Current Rating: 100mA; Current Rating: 100mA; Contact Material: Copper; Length: 0.858inch; Digi-Key_Part_Number_1: CT3121CT-ND

## Nets that join several sheets
GND_1: Microcontroller Schematic (7 pins), 100 Pin Header Breakout Schematic (7 pins), Circuit Schematics (42 pins)
VDDCORE_1: Microcontroller Schematic (5 pins), 100 Pin Header Breakout Schematic (5 pins), Circuit Schematics (8 pins)
VDDIN: Microcontroller Schematic (7 pins), 100 Pin Header Breakout Schematic (7 pins), Circuit Schematics (33 pins)
VDDPLL: Microcontroller Schematic (B1.86), 100 Pin Header Breakout Schematic (J10.86), Circuit Schematics (C14.1 FB1.2)
VDDUTMIC: Microcontroller Schematic (B1.96), 100 Pin Header Breakout Schematic (J10.96), Circuit Schematics (C15.1 FB2.2)
HSDM: Microcontroller Schematic (B1.94), 100 Pin Header Breakout Schematic (J10.94)
HSDP: Microcontroller Schematic (B1.95), 100 Pin Header Breakout Schematic (J10.95)
JTAGSEL: Microcontroller Schematic (B1.73), 100 Pin Header Breakout Schematic (J10.73)
NRST: Microcontroller Schematic (B1.58), 100 Pin Header Breakout Schematic (J10.58), Circuit Schematics (J3.6 P1.1 S1.1 S1.2)
PA0: Microcontroller Schematic (B1.72), 100 Pin Header Breakout Schematic (J10.72)
PA1: Microcontroller Schematic (B1.70), 100 Pin Header Breakout Schematic (J10.70)
PA2: Microcontroller Schematic (B1.66), 100 Pin Header Breakout Schematic (J10.66), Circuit Schematics (Q3.3 R23.2)
PA3: Microcontroller Schematic (B1.64), 100 Pin Header Breakout Schematic (J10.64), Circuit Schematics (J1.5 J4.17 R14.1)
PA4: Microcontroller Schematic (B1.55), 100 Pin Header Breakout Schematic (J10.55), Circuit Schematics (J1.4 J4.16 R13.1)
PA5: Microcontroller Schematic (B1.52), 100 Pin Header Breakout Schematic (J10.52)
PA7: Microcontroller Schematic (B1.24), 100 Pin Header Breakout Schematic (J10.24)
PA8: Microcontroller Schematic (B1.25), 100 Pin Header Breakout Schematic (J10.25)
PA9: Microcontroller Schematic (B1.54), 100 Pin Header Breakout Schematic (J10.54)
PA10: Microcontroller Schematic (B1.46), 100 Pin Header Breakout Schematic (J10.46)
PA11: Microcontroller Schematic (B1.44), 100 Pin Header Breakout Schematic (J10.44)
PA12: Microcontroller Schematic (B1.48), 100 Pin Header Breakout Schematic (J10.48), Circuit Schematics (Q5.3 R27.2)
PA13: Microcontroller Schematic (B1.27), 100 Pin Header Breakout Schematic (J10.27), Circuit Schematics (Q1.3 R19.2)
PA14: Microcontroller Schematic (B1.34), 100 Pin Header Breakout Schematic (J10.34)
PA15: Microcontroller Schematic (B1.33), 100 Pin Header Breakout Schematic (J10.33), Circuit Schematics (J1.6)
PA16: Microcontroller Schematic (B1.30), 100 Pin Header Breakout Schematic (J10.30)
PA17: Microcontroller Schematic (B1.16), 100 Pin Header Breakout Schematic (J10.16), Circuit Schematics (Q2.3 R21.2)
PA18: Microcontroller Schematic (B1.15), 100 Pin Header Breakout Schematic (J10.15), Circuit Schematics (J4.12)
PA19: Microcontroller Schematic (B1.14), 100 Pin Header Breakout Schematic (J10.14)
PA20: Microcontroller Schematic (B1.13), 100 Pin Header Breakout Schematic (J10.13)
PA21: Microcontroller Schematic (B1.21), 100 Pin Header Breakout Schematic (J10.21)
PA22: Microcontroller Schematic (B1.26), 100 Pin Header Breakout Schematic (J10.26)
PA23: Microcontroller Schematic (B1.31), 100 Pin Header Breakout Schematic (J10.31)
PA24: Microcontroller Schematic (B1.38), 100 Pin Header Breakout Schematic (J10.38)
PA25: Microcontroller Schematic (B1.40), 100 Pin Header Breakout Schematic (J10.40)
PA26: Microcontroller Schematic (B1.42), 100 Pin Header Breakout Schematic (J10.42)
PA27: Microcontroller Schematic (B1.50), 100 Pin Header Breakout Schematic (J10.50)
PA28: Microcontroller Schematic (B1.79), 100 Pin Header Breakout Schematic (J10.79)
PA30: Microcontroller Schematic (B1.82), 100 Pin Header Breakout Schematic (J10.82)
PA31: Microcontroller Schematic (B1.83), 100 Pin Header Breakout Schematic (J10.83)
PB0: Microcontroller Schematic (B1.12), 100 Pin Header Breakout Schematic (J10.12)
PB1: Microcontroller Schematic (B1.11), 100 Pin Header Breakout Schematic (J10.11)
PB2: Microcontroller Schematic (B1.17), 100 Pin Header Breakout Schematic (J10.17), Circuit Schematics (J4.18)
PB3: Microcontroller Schematic (B1.20), 100 Pin Header Breakout Schematic (J10.20), Circuit Schematics (J2.6)
PB4: Microcontroller Schematic (B1.74), 100 Pin Header Breakout Schematic (J10.74)
PB5: Microcontroller Schematic (B1.77), 100 Pin Header Breakout Schematic (J10.77), Circuit Schematics (R17.1)
PB6: Microcontroller Schematic (B1.57), 100 Pin Header Breakout Schematic (J10.57), Circuit Schematics (R15.1)
PB7: Microcontroller Schematic (B1.63), 100 Pin Header Breakout Schematic (J10.63), Circuit Schematics (R16.1)
PB8: Microcontroller Schematic (B1.98), 100 Pin Header Breakout Schematic (J10.98)
PB9: Microcontroller Schematic (B1.99), 100 Pin Header Breakout Schematic (J10.99)
PB12: Microcontroller Schematic (B1.61), 100 Pin Header Breakout Schematic (J10.61), Circuit Schematics (P2.1)
PB13: Microcontroller Schematic (B1.100), 100 Pin Header Breakout Schematic (J10.100)
PD0: Microcontroller Schematic (B1.1), 100 Pin Header Breakout Schematic (J10.1)
PD1: Microcontroller Schematic (B1.92), 100 Pin Header Breakout Schematic (J10.92), Circuit Schematics (J2.2)
PD2: Microcontroller Schematic (B1.91), 100 Pin Header Breakout Schematic (J10.91), Circuit Schematics (J2.7)
PD3: Microcontroller Schematic (B1.89), 100 Pin Header Breakout Schematic (J10.89), Circuit Schematics (J1.10)
PD4: Microcontroller Schematic (B1.88), 100 Pin Header Breakout Schematic (J10.88), Circuit Schematics (J4.13)
PD5: Microcontroller Schematic (B1.87), 100 Pin Header Breakout Schematic (J10.87), Circuit Schematics (J4.14)
PD6: Microcontroller Schematic (B1.85), 100 Pin Header Breakout Schematic (J10.85), Circuit Schematics (J4.11)
PD7: Microcontroller Schematic (B1.84), 100 Pin Header Breakout Schematic (J10.84), Circuit Schematics (D1.2)
PD8: Microcontroller Schematic (B1.80), 100 Pin Header Breakout Schematic (J10.80), Circuit Schematics (D2.2)
PD9: Microcontroller Schematic (B1.78), 100 Pin Header Breakout Schematic (J10.78), Circuit Schematics (D3.2)
PD10: Microcontroller Schematic (B1.71), 100 Pin Header Breakout Schematic (J10.71), Circuit Schematics (D4.2)
PD11: Microcontroller Schematic (B1.69), 100 Pin Header Breakout Schematic (J10.69), Circuit Schematics (Q4.3 R25.2)
PD12: Microcontroller Schematic (B1.65), 100 Pin Header Breakout Schematic (J10.65), Circuit Schematics (R1.1 SW1.1)
PD13: Microcontroller Schematic (B1.62), 100 Pin Header Breakout Schematic (J10.62), Circuit Schematics (R2.1 SW1.2)
PD14: Microcontroller Schematic (B1.59), 100 Pin Header Breakout Schematic (J10.59), Circuit Schematics (R3.1 SW1.3)
PD15: Microcontroller Schematic (B1.75), 100 Pin Header Breakout Schematic (J10.75), Circuit Schematics (R4.1 SW1.4)
PD16: Microcontroller Schematic (B1.56), 100 Pin Header Breakout Schematic (J10.56), Circuit Schematics (R5.1 SW1.5)
PD17: Microcontroller Schematic (B1.53), 100 Pin Header Breakout Schematic (J10.53), Circuit Schematics (R6.1 SW1.6)
PD18: Microcontroller Schematic (B1.49), 100 Pin Header Breakout Schematic (J10.49), Circuit Schematics (R7.1 SW1.7)
PD19: Microcontroller Schematic (B1.47), 100 Pin Header Breakout Schematic (J10.47), Circuit Schematics (R8.1 SW1.8)
PD20: Microcontroller Schematic (B1.45), 100 Pin Header Breakout Schematic (J10.45), Circuit Schematics (J2.3)
PD21: Microcontroller Schematic (B1.43), 100 Pin Header Breakout Schematic (J10.43), Circuit Schematics (J2.4)
PD22: Microcontroller Schematic (B1.41), 100 Pin Header Breakout Schematic (J10.41), Circuit Schematics (J2.5)
PD24: Microcontroller Schematic (B1.37), 100 Pin Header Breakout Schematic (J10.37)
PD25: Microcontroller Schematic (B1.35), 100 Pin Header Breakout Schematic (J10.35)
PD26: Microcontroller Schematic (B1.36), 100 Pin Header Breakout Schematic (J10.36)
PD27: Microcontroller Schematic (B1.32), 100 Pin Header Breakout Schematic (J10.32)
PD28: Microcontroller Schematic (B1.51), 100 Pin Header Breakout Schematic (J10.51)
PD30: Microcontroller Schematic (B1.23), 100 Pin Header Breakout Schematic (J10.23), Circuit Schematics (J4.19)
PD31: Microcontroller Schematic (B1.2), 100 Pin Header Breakout Schematic (J10.2)
TST: Microcontroller Schematic (B1.60), 100 Pin Header Breakout Schematic (J10.60)
VBG: Microcontroller Schematic (B1.97), 100 Pin Header Breakout Schematic (J10.97)
VREFP: Microcontroller Schematic (B1.9), 100 Pin Header Breakout Schematic (J10.9), Circuit Schematics (J4.20)